# EAGLE design barcamp_water (EAGLE 9.3.0)
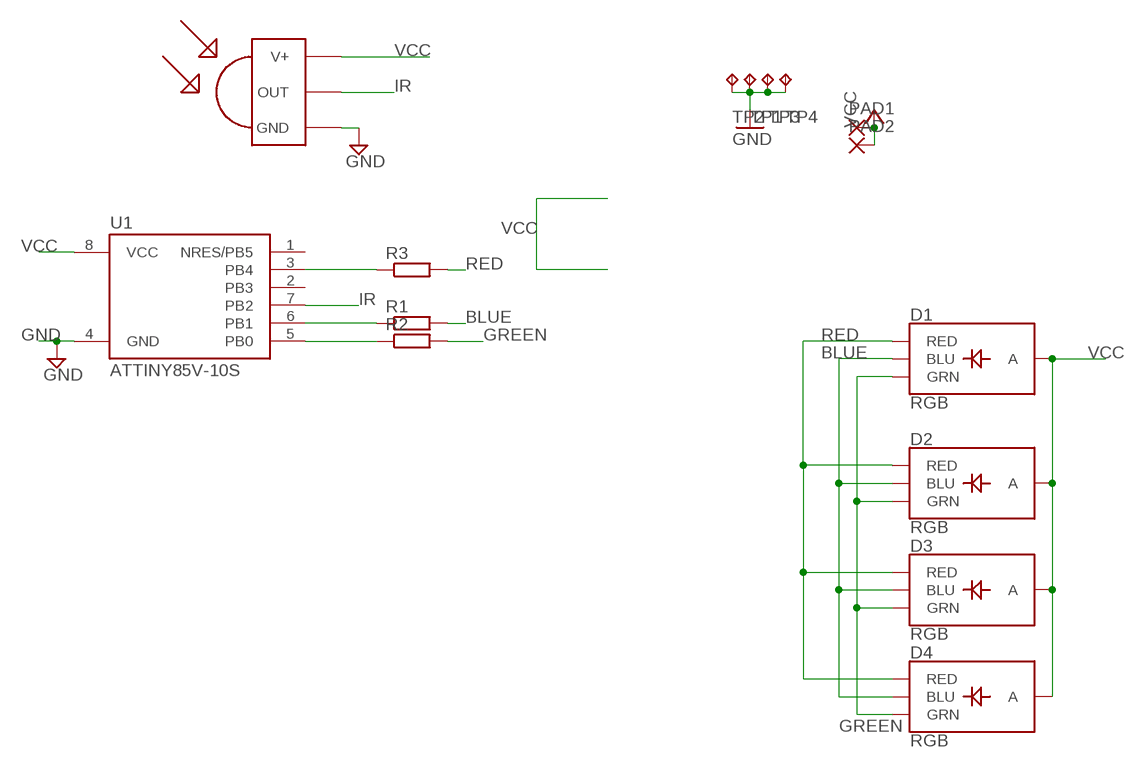
[diagram p0: schematic, sheet 1]

## Parts
D1  RGB  LED-RGB-CAPLCC  [P-LCC-4-3]
D2  RGB  LED-RGB-CAPLCC  [P-LCC-4-3]
D3  RGB  LED-RGB-CAPLCC  [P-LCC-4-3]
D4  RGB  LED-RGB-CAPLCC  [P-LCC-4-3]
PAD1  3,17/1,3  [3,17/1,3]
PAD2  3,17/1,3  [3,17/1,3]
R1  12ohm  R-EU_R0603  [R0603]
R2  12ohm  R-EU_R0603  [R0603]
R3  R-EU_R0603  [R0603]
TP1  TPTP20SQ  [TP20SQ]
TP2  TPTP20SQ  [TP20SQ]
TP3  TPTP20SQ  [TP20SQ]
TP4  TPTP20SQ  [TP20SQ]
U1  ATTINY85V-10S  [SOIC8_EIAJ_208MIL]
U$1  TSOP4838  [TSOP18XX]

## Nets
BLUE: D1.3(BLU) D2.3(BLU) D3.3(BLU) D4.3(BLU) R1.2
GND: TP1.TP TP2.TP TP3.TP TP4.TP U1.4(GND) U$1.GND
GREEN: D1.2(GRN) D2.2(GRN) D3.2(GRN) D4.2(GRN) R2.2
IR: U1.7(PB2) U$1.OUT
N$1: R1.1 U1.6(PB1)
N$2: R2.1 U1.5(PB0)
N$3: R3.1 U1.3(PB4)
RED: D1.1(RED) D2.1(RED) D3.1(RED) D4.1(RED) R3.2
VCC: D1.4(A) D2.4(A) D3.4(A) D4.4(A) PAD1.1(P) PAD2.1(P) U1.8(VCC) U$1.VCC(V+)
Unconnected: U1.1(NRES/PB5) U1.2(PB3)

## Library data of the parts
D1-D4 = SparkFun-LED:LED-RGB-CA: LED-RGB Diffused Common Anode Packages: LED RGB-THRU P-LCC-4-3 LED-TRICOLOR-SMD SparkFun Products: RGB Diffused Common Anode- Diffuse <[https://www.sparkfun.com/products/10821]> RGB Diffused Common Anode - Clear <[https://www.sparkfun.com/products/10820]> Qduino Mini <[https://www.sparkfun.com/products/13614]> Triple Output LED RGB - SMD <https://www.sparkfun.com/products/7844>; PROD_ID: DIO-12986
PAD1 PAD2 = wirepad:3,17/1,3: THROUGH-HOLE PAD
R1-R3 = rcl:R-EU_: RESISTOR, European symbol; SPICEPREFIX: R
TP1-TP4 = testpad:TP: Test pad
U1 = _hhn_attiny25_45_85:ATTINY85*: ATMEL ATtiny 85 Packages: P = PDIP 08 30mil S = SOIC 08 EIAJ 208mil Technologies Note: for complete ordering code (temp. range, finish, tape&reel etc.) see www.atmel.com • Supply Voltage: V = (1.8…5.5)V | [blank] = (2.7…5.5)V • Speed: 10 = 10 MHz | 20 = 20 MHz Author: Dipl.-Ing. FH Rainer Bayer HHN Hochschule Heilbronn (Heilbronn University), rainer.bayer@hs-heilbronn.de Ingenieurbüro ing-rb, mail@ing-rb.de
U$1 = tsop:TSOP4838: IR Receiver and Demodulator

## Board
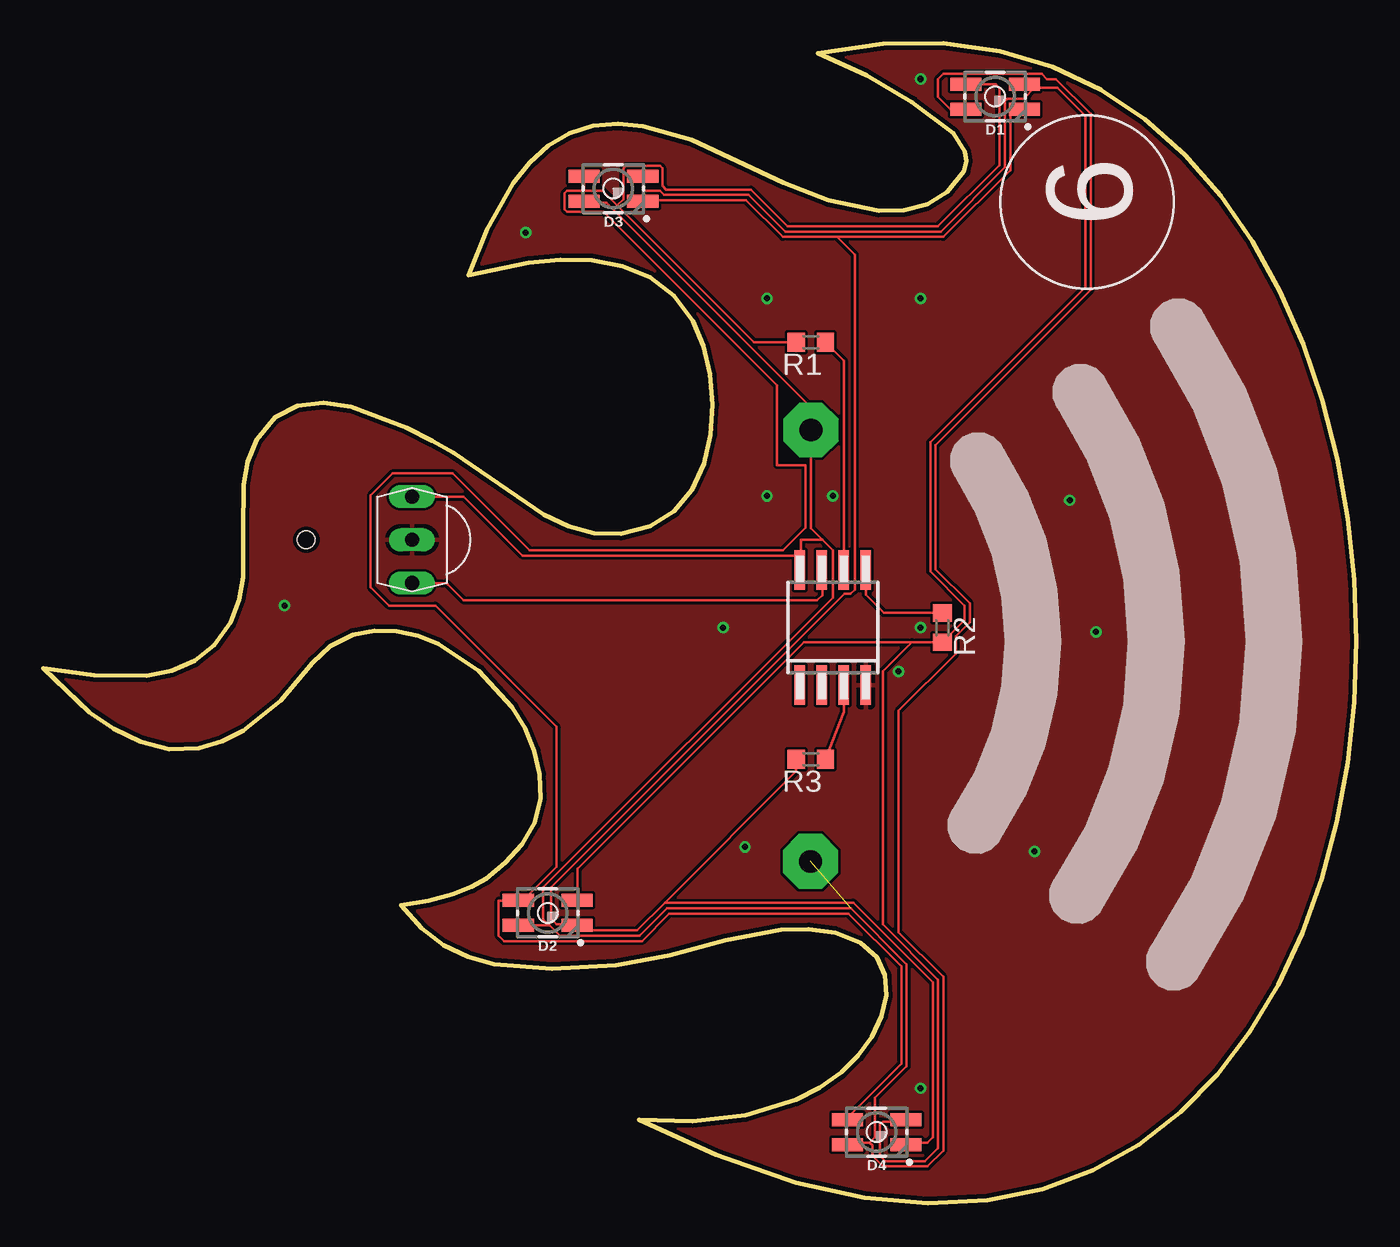
[diagram p1: board, top side]
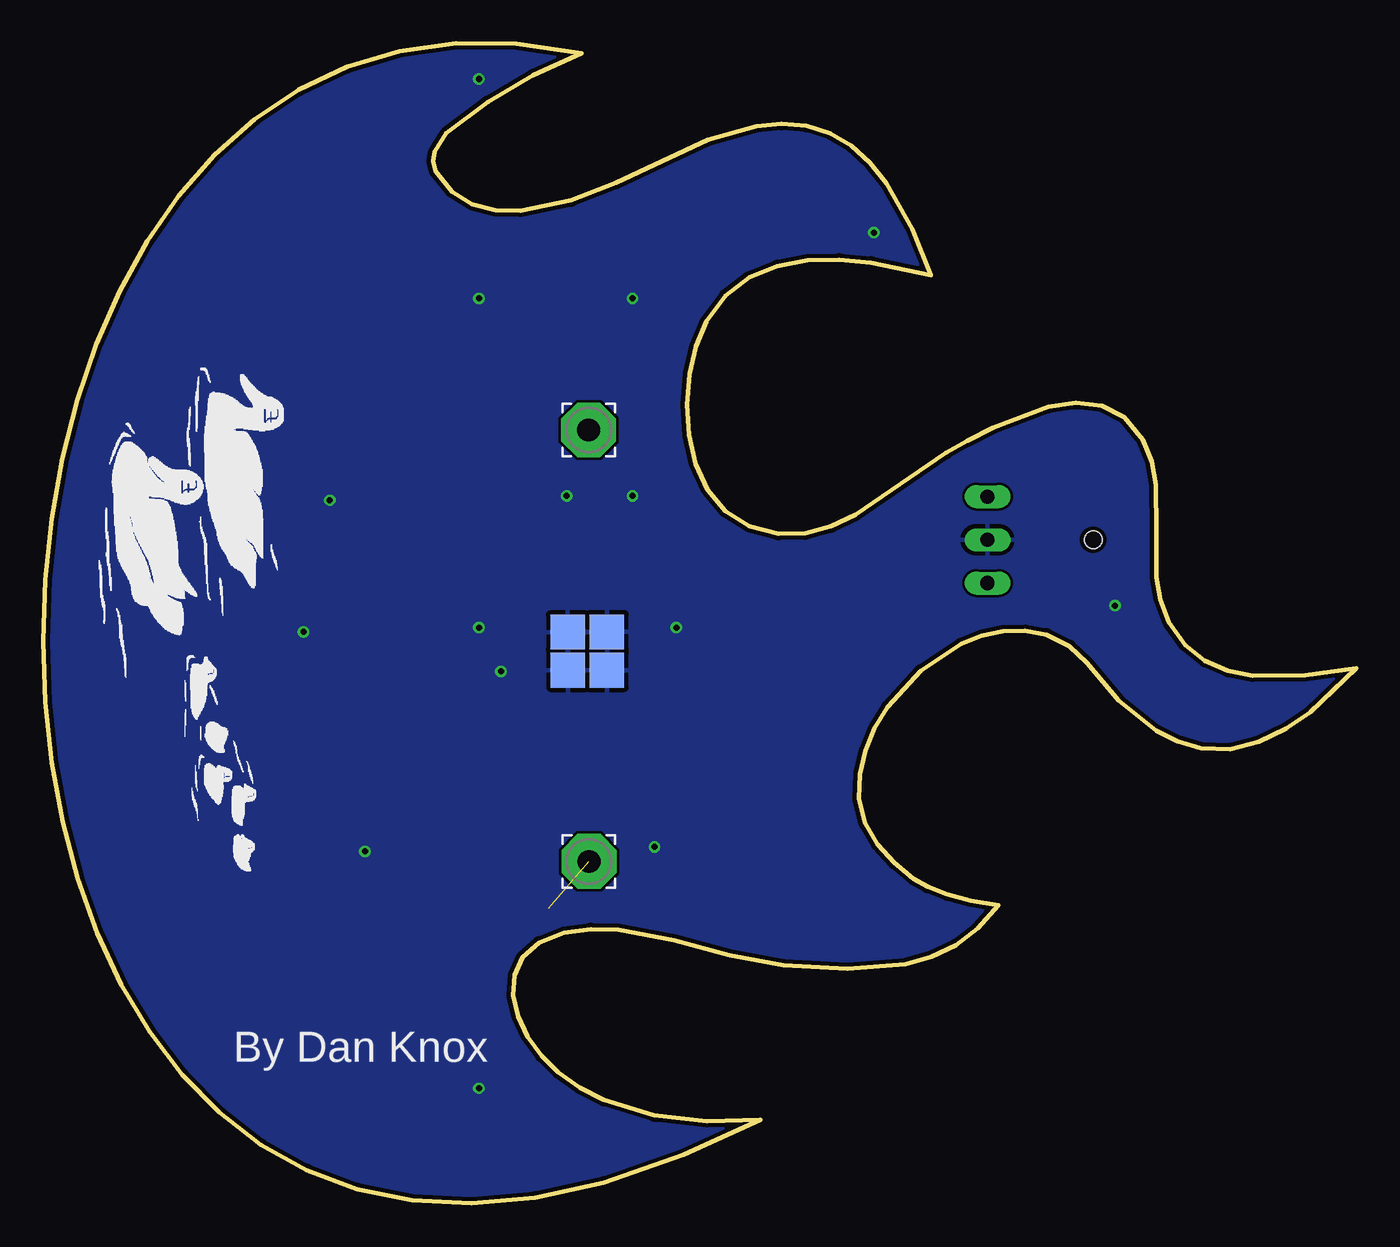
[diagram p2: board, bottom side, seen from below]

Size 76.03 x 67.15 mm. Coordinates in mm from the lower left corner, seen from the top.
Outline: 17.94,32.92 16.61,32.26 15.61,31.3 13.76,29.1 11.59,27.36 10.38,26.75 9,26.34 7.29,26.3 5.64,26.71 4.09,27.46 2.67,28.42 0,30.97 2.96,30.58 6,30.54 7.44,30.83 8.76,31.4 9.91,32.31 10.85,33.65 11.34,34.93 11.57,36.24 11.57,38.91 11.6,41.6 11.85,42.92 12.37,44.21 13.42,45.5 14.74,46.17 16.24,46.33 17.84,46.1 21.06,44.9 22.51,44.14 23.75,43.44 28.99,39.87 30.41,39.18 31.9,38.78 33.47,38.75 35.14,39.2 36.53,40.07 37.56,41.3 38.26,42.8 38.65,44.48 38.76,46.24 38.61,47.98 38.23,49.62 37.63,51.05 36.53,52.55 35.15,53.6 33.54,54.25 31.78,54.58 29.95,54.63 28.09,54.46 24.62,53.71 25.7,56.39 27.21,59.06 28.16,60.23 29.24,61.21 30.47,61.94 31.85,62.37 33.29,62.48 34.73,62.35 37.55,61.55 42.87,59.07 45.46,58.06 48.41,57.46 49.85,57.49 51.19,57.83 52.37,58.56 53.32,59.73 53.45,60.32 53.37,60.88 52.7,61.93 50.3,63.74 47.66,65.3 44.87,66.58 48.61,67.13 52.12,67.15 55.4,66.69 58.43,65.78 61.23,64.45 63.79,62.74 66.11,60.69 68.18,58.32 70.02,55.69 71.61,52.81 72.96,49.73 74.07,46.49 74.93,43.11 75.54,39.64 75.91,36.11 76.03,32.55 75.91,29 75.53,25.5 74.9,22.08 74.02,18.78 72.89,15.63 71.51,12.67 69.87,9.93 67.98,7.45 65.83,5.26 63.43,3.41 60.77,1.92 57.85,0.83 54.68,0.18 51.24,0 47.55,0.33 43.59,1.2 38.95,2.8 34.49,4.85 37.58,4.76 40.66,5.1 43.58,5.99 44.94,6.69 46.21,7.58 47.19,8.53 47.98,9.64 48.55,10.84 48.82,12.06 48.74,13.22 48.26,14.25 47.33,15.09 45.88,15.66 44.31,15.87 42.72,15.83 39.5,15.22 36.29,14.36 33.17,13.78 29.47,13.57 26.12,13.84 24.6,14.27 23.19,14.95 21.9,15.93 20.74,17.26 22.33,17.53 23.7,17.89 24.81,18.32 25.63,18.79 26.75,19.7 27.74,20.79 28.46,22.03 28.79,23.43 28.75,24.84 28.44,26.21 27.89,27.51 27.16,28.73 25.21,30.84 22.88,32.39 21.7,32.85 20.45,33.11 19.18,33.14 17.94,32.92
Copper layers (1*16): Top 0.035mm / dielectric 1.5mm / Bottom 0.035mm
Design rules "SeeedStudio": minimum track width 6mil, minimum drill 12mil, track to track 6mil, track to pad 6mil, pad to pad 6mil, via to via 6mil, smd to smd 0mil, copper to edge 10mil, drill to drill 10mil, minimum pad ring 10mil, minimum via ring 6mil, stop-mask expansion 2mil, vias tented up to drill 100mil, thermal gap 10mil
Holes 1 mm at 15.24,38.41

### Footprints (pad centres in the part's own frame; a part is rotated, then mirrored left to right if it is on the bottom)
P-LCC-4-3 = smd 1.8 x 0.75: 1 -1.7,0.725; 2 -1.7,-0.725; 3 1.7,-0.725; 4 1.7,0.725
3,17/1,3 = drill 1.321 pad 3.175 octagon: 1 0,0
R0603 = smd 1 x 1.1: 1 -0.85,0; 2 0.85,0
TP20SQ = smd 2 x 2: TP 0,0
SOIC8_EIAJ_208MIL = smd 0.6 x 2.286: 1 -1.905,-3.33; 2 -0.635,-3.33; 3 0.635,-3.33; 4 1.905,-3.33; 5 1.905,3.33; 6 0.635,3.33; 7 -0.635,3.33; 8 -1.905,3.33
TSOP18XX = drill 0.813 long: GND -0.001,-0.027; OUT -2.501,-0.027; VCC 2.499,-0.027

### Placement (x,y rotation side)
D1  55.12,64.06 180 top
D2  29.21,16.82 180 top
D3  33.02,58.73 180 top
D4  48.26,4.12 180 top
PAD1  44.43,19.79 0 bottom
PAD2  44.45,44.77 0 bottom
R1  44.45,49.84 180 top
R2  52.07,33.33 270 top
R3  44.45,25.71 180 top
TP1  45.66,33.07 0 bottom
TP2  43.4,33.08 0 bottom
TP3  45.65,30.86 0 bottom
TP4  43.39,30.86 0 bottom
U1  45.72,33.33 0 top
U$1  21.33,38.41 90 top

### Tracks (layer width: path | path; a pad name or v marks a point on that pad's centre or on a via)
BLUE
  Top 0.152: D4.3 46.48,4.88 49.68,8.08 49.68,13.72 46.63,16.77 36.24,16.77 34.66,15.19 26.69,15.19 26.38,15.49 26.38,17.53 27.5,17.53 | 33.22,57.77 41.15,49.84 R1.2 | 27.5,17.53 D2.3 | D3.3 31.32,58.61 | 31.32,58.61 30.32,58.61 30.19,58.48 30.19,57.54 30.32,57.4 32.46,57.4 42.5,47.36 42.5,42.73 44.15,42.73 44.15,39.12 42.82,37.8 28.16,37.8 23.71,42.26 20.24,42.26 18.97,40.99 18.97,35.65 20.02,34.6 22.71,34.6 29.72,27.59 29.72,19.49 27.76,17.53 27.5,17.53 | 33.22,57.77 32.38,58.61 31.32,58.61 | 33.22,57.77 33.59,58.13 33.59,59.93 33.73,60.06 35.72,60.06 35.85,59.93 35.85,58.91 36.08,58.68 40.97,58.68 43.1,56.55 51.82,56.55 55.37,60.1 55.37,64.57 55.16,64.79 D1.3
GND  (via drill 0.35)
  other vias: 39.37,33.33 40.64,20.63 50.8,33.33 50.8,52.38 41.91,52.38 13.97,34.6 41.91,40.95 27.94,56.19 50.8,6.66 45.72,40.95 50.8,65.08 49.53,30.79 57.4,20.38 60.96,33.08 59.44,40.7
  pour Top: 0,72.7 87.63,72.7 87.63,-4.77 -1.27,-4.77 -1.27,72.7
  pour Bottom: -17.78,77.78 91.44,77.78 91.44,-12.39 -7.62,-12.39 -7.62,67.62
GREEN
  Top 0.152: D4.2 49.84,4.73 48.62,4.73 48.46,4.58 48.46,2.75 48.77,2.44 51.05,2.44 51.82,3.21 51.82,12.96 48.62,16.16 48.62,30.79 50.31,32.48 | D2.2 30.94,17.68 30.94,19.36 44.06,32.48 50.31,32.48 | D3.2 34.72,58.61 35.72,58.61 35.95,58.37 40.84,58.37 42.98,56.24 51.97,56.24 55.69,59.96 55.69,63.81 55.82,63.94 56.77,63.94 57.4,64.57 | 50.31,32.48 R2.2 53.34,33.75 53.34,34.6 51.36,36.58 51.36,44.05 60.35,53.04 60.35,62.95 58.73,64.57 57.4,64.57 | D1.2 57.03,64.57 57.4,64.57
IR
  Top 0.152: U1.7 45.11,36.58 45.11,35.21 44.81,34.91 24.35,34.91 23.41,35.84 23.32,35.91 U$1.OUT
N$1
  Top 0.152: R1.1 46.35,48.79 U1.6
N$2
  Top 0.152: U1.5 47.62,35.23 48.68,34.18 R2.1
N$3
  Top 0.152: R3.1 46.35,28.47 U1.3
RED
  Top 0.152: 45.97,55.94 52.12,55.94 55.99,59.81 55.99,63.05 56.28,63.34 D1.1 | 45.97,55.94 42.82,55.94 40.69,58.07 34.75,58.07 D3.1 | D4.1 49.99,3.51 51.21,3.51 51.51,3.82 51.51,12.81 46.91,17.4 35.99,17.4 | 45.97,55.94 46.99,54.92 46.99,35.53 46.75,35.29 46.41,35.29 29.41,18.29 29.41,16.46 29.72,16.16 30.79,16.16 D2.1 31.21,15.8 34.38,15.8 35.99,17.4 | 35.99,17.4 43.6,25.01 R3.2
VCC  (1 unrouted)
  Top 0.152: D3.4 31.39,57.92 32.61,57.92 44.45,46.08 | 43.89,37.5 43.89,38.41 45.11,38.41 | 43.89,37.5 43.89,36.73 U1.8 43.89,37.5 | U$1.VCC 24.35,40.91 27.77,37.5 43.89,37.5 | 47.85,3.51 46.63,3.51 D4.4 | 47.85,3.51 48.16,3.82 48.16,6.1 49.99,7.93 49.99,13.85 46.76,17.07 36.12,17.07 34.54,15.49 29.91,15.49 29.31,16.09 | 47.85,3.51 48.01,3.36 48.01,2.75 48.62,2.14 51.21,2.14 52.12,3.05 52.12,13.11 49.53,15.7 49.53,28.5 52.85,31.82 52.85,32.83 53.65,33.62 53.65,34.73 51.66,36.71 51.66,43.9 60.66,52.89 60.66,63.07 58.65,65.08 58.12,65.08 57.81,65.39 52.13,65.39 51.82,65.08 51.82,64.06 52.54,63.34 D1.4 | 45.11,38.41 45.72,37.8 45.72,35.06 28.96,18.29 28.96,16.45 29.31,16.09 | 44.45,46.08 | D2.4 29.31,16.09 | 44.45,46.08 PAD2.1 44.45,42.86 44.45,42.85 44.45,39.07 45.11,38.41

### Text on the board
tPlace: 6
bPlace: By Dan Knox